# EAGLE design power_adc_module (EAGLE 9.6.2)
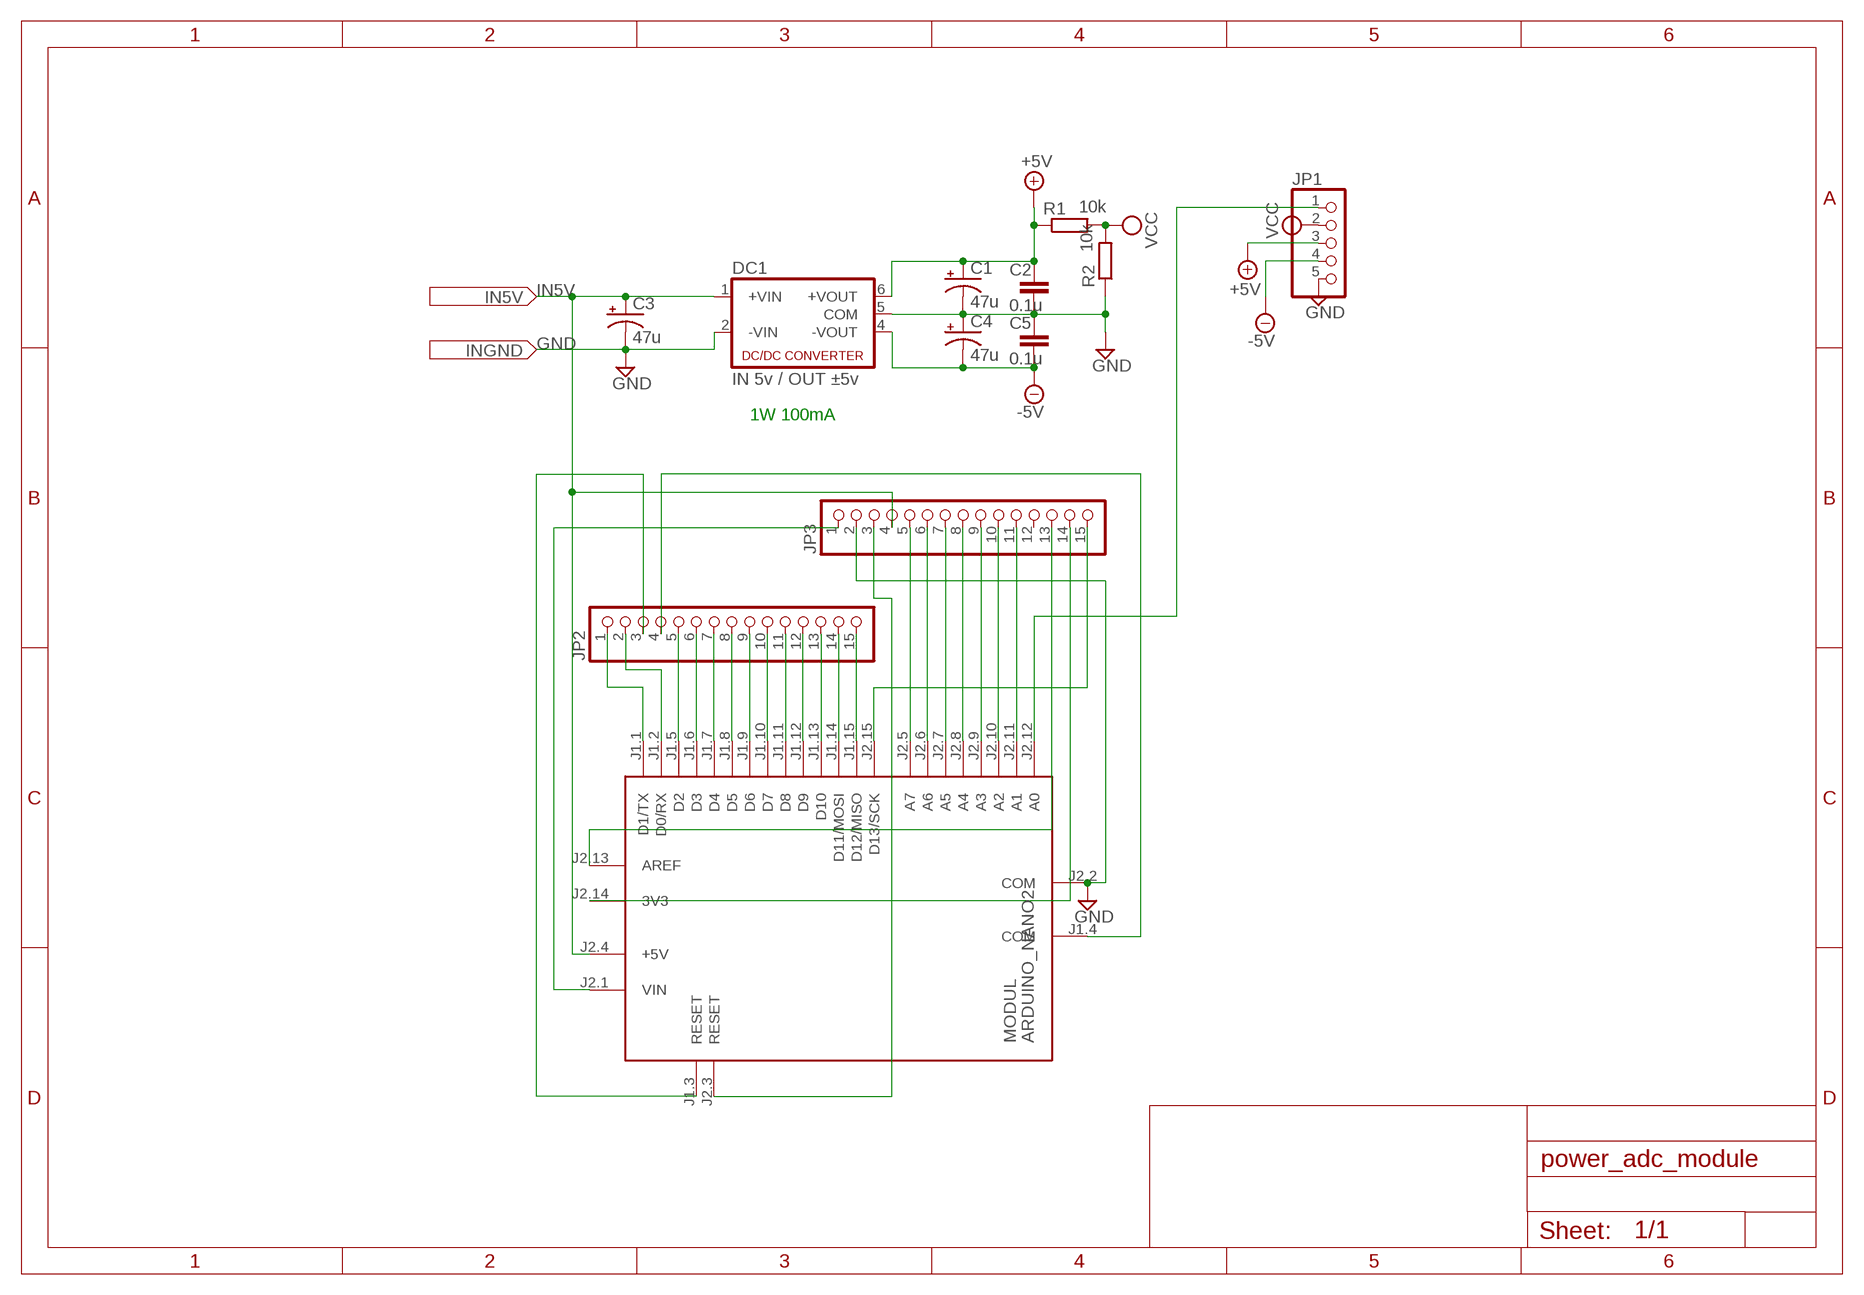
[diagram p0: schematic, sheet 1]

## Parts
C1  47u  CPOL-USE2.5-5  [E2,5-5]
C2  0.1u  C-EU025-024X044  [C025-024X044]
C3  47u  CPOL-USE2.5-5  [E2,5-5]
C4  47u  CPOL-USE2.5-5  [E2,5-5]
C5  0.1u  C-EU025-024X044  [C025-024X044]
DC1  IN 5v / OUT ±5v  NMA  [NMA]
JP1  PINHD-1X5  [1X05]
JP2  PINHD-1X15  [1X15]
JP3  PINHD-1X15  [1X15]
MODUL  ARDUINO_NANO2  [ARDUINO_NANO2]
R1  10k  R-EU_0204/7  [0204/7]
R2  10k  R-EU_0204/7  [0204/7]

## Nets
+5V: C1.+ C2.1 DC1.6(+VOUT) JP1.3 R1.1
-5V: C4.- C5.2 DC1.4(-VOUT) JP1.4
GND: C1.- C2.2 C3.- C4.+ C5.1 DC1.2(-VIN) DC1.5(COM) JP1.5 JP3.2 MODUL.J2.2(COM) R2.1
IN5V: C3.+ DC1.1(+VIN) JP3.4 MODUL.J2.4(+5V)
N$1: JP1.1 MODUL.J2.12(A0)
N$2: JP2.2 MODUL.J1.2(D0/RX)
N$3: JP2.1 MODUL.J1.1(D1/TX)
N$4: JP2.3 MODUL.J1.3(RESET)
N$5: JP2.4 MODUL.J1.4(COM)
N$6: JP2.5 MODUL.J1.5(D2)
N$7: JP2.6 MODUL.J1.6(D3)
N$8: JP2.7 MODUL.J1.7(D4)
N$9: JP2.8 MODUL.J1.8(D5)
N$10: JP2.9 MODUL.J1.9(D6)
N$11: JP2.10 MODUL.J1.10(D7)
N$12: JP2.11 MODUL.J1.11(D8)
N$13: JP2.12 MODUL.J1.12(D9)
N$14: JP2.13 MODUL.J1.13(D10)
N$15: JP2.14 MODUL.J1.14(D11/MOSI)
N$16: JP2.15 MODUL.J1.15(D12/MISO)
N$17: JP3.1 MODUL.J2.1(VIN)
N$18: JP3.3 MODUL.J2.3(RESET)
N$19: JP3.5 MODUL.J2.5(A7)
N$20: JP3.6 MODUL.J2.6(A6)
N$21: JP3.7 MODUL.J2.7(A5)
N$22: JP3.8 MODUL.J2.8(A4)
N$23: JP3.9 MODUL.J2.9(A3)
N$24: JP3.10 MODUL.J2.10(A2)
N$25: JP3.11 MODUL.J2.11(A1)
N$26: JP3.15 MODUL.J2.15(D13/SCK)
N$27: JP3.13 MODUL.J2.13(AREF)
N$28: JP3.14 MODUL.J2.14(3V3)
VCC: JP1.2 R1.2 R2.2
Unconnected: JP3.12

## Notes on the sheet
- 1W 100mA

## Library data of the parts
C1 C3 C4 = rcl:CPOL-US: POLARIZED CAPACITOR, American symbol; SPICEPREFIX: C
C2 C5 = rcl:C-EU: CAPACITOR, European symbol; SPICEPREFIX: C
DC1 = dc-dc-converter:NMA: DC-DC CONVERTER; MF: C & D TECHNOLOGIES, INC; MPN: NMA0515SC; OC_FARNELL: 1021434; OC_NEWARK: 61K3064
JP1 = pinhead:PINHD-1X5: PIN HEADER
JP2 JP3 = pinhead:PINHD-1X15: PIN HEADER
MODUL = arduino:ARDUINO_NANO2: Arduino Nano2 Auto generated by modulcreator.ulp \;; ANZAHL: 2; MODUL: TRUE; STECKX0: -76200; STECKX1: 76200; STECKY0: 177800; STECKY1: 177800
R1 R2 = rcl:R-EU_: RESISTOR, European symbol; SPICEPREFIX: R

## Net classes
0 default: width 1.27 mm, clearance 0.381 mm

## Board
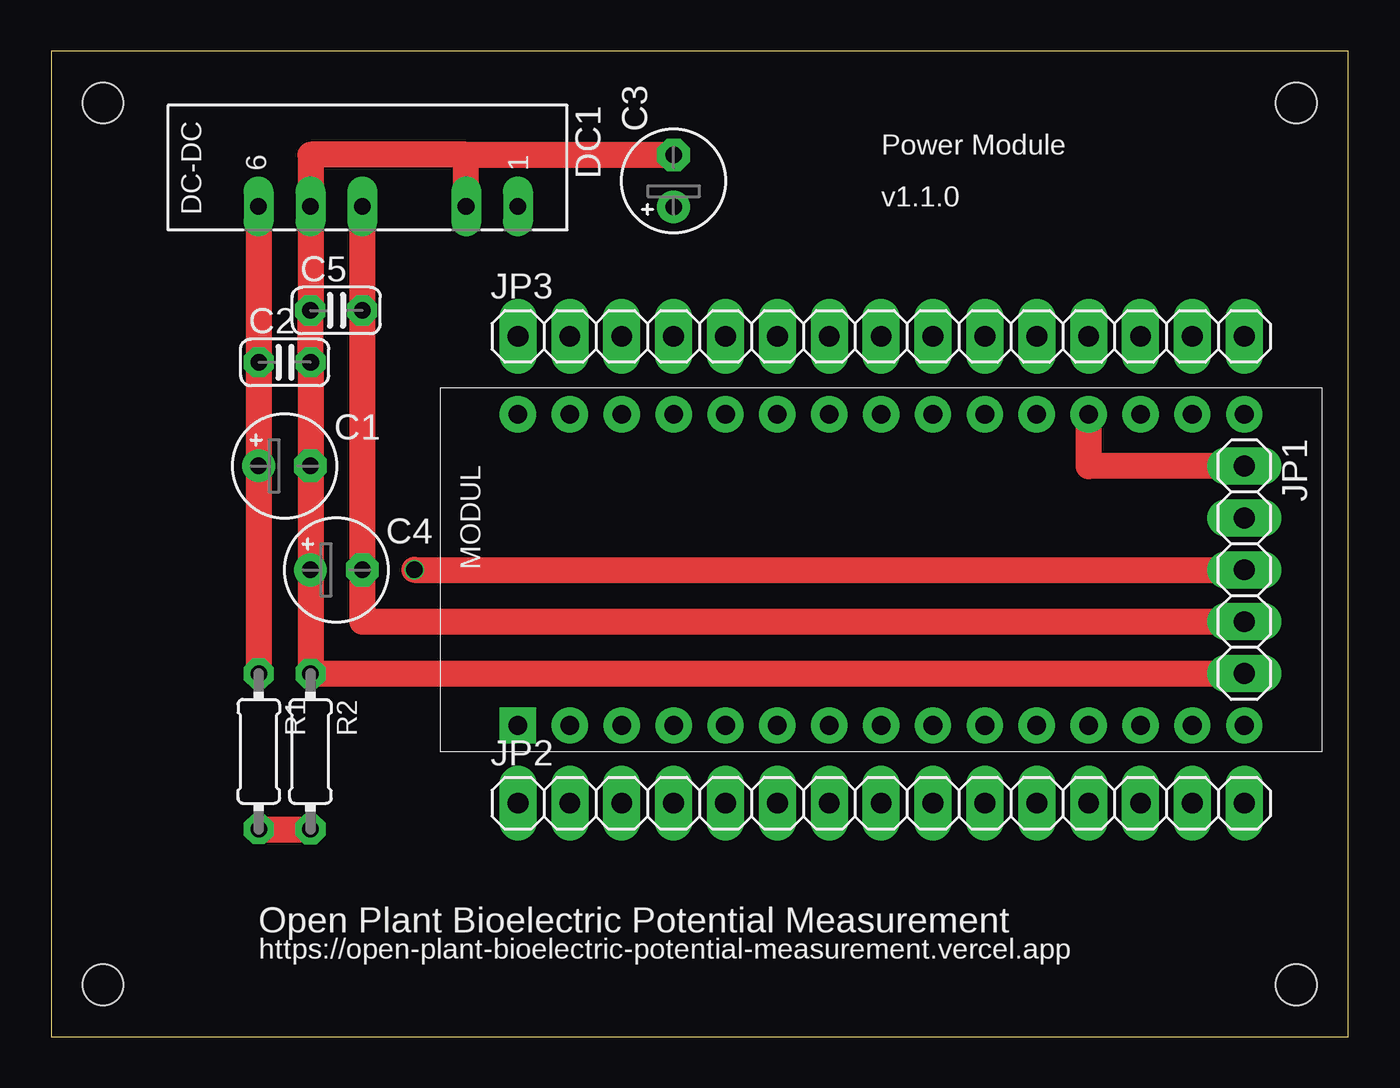
[diagram p1: board, top side]
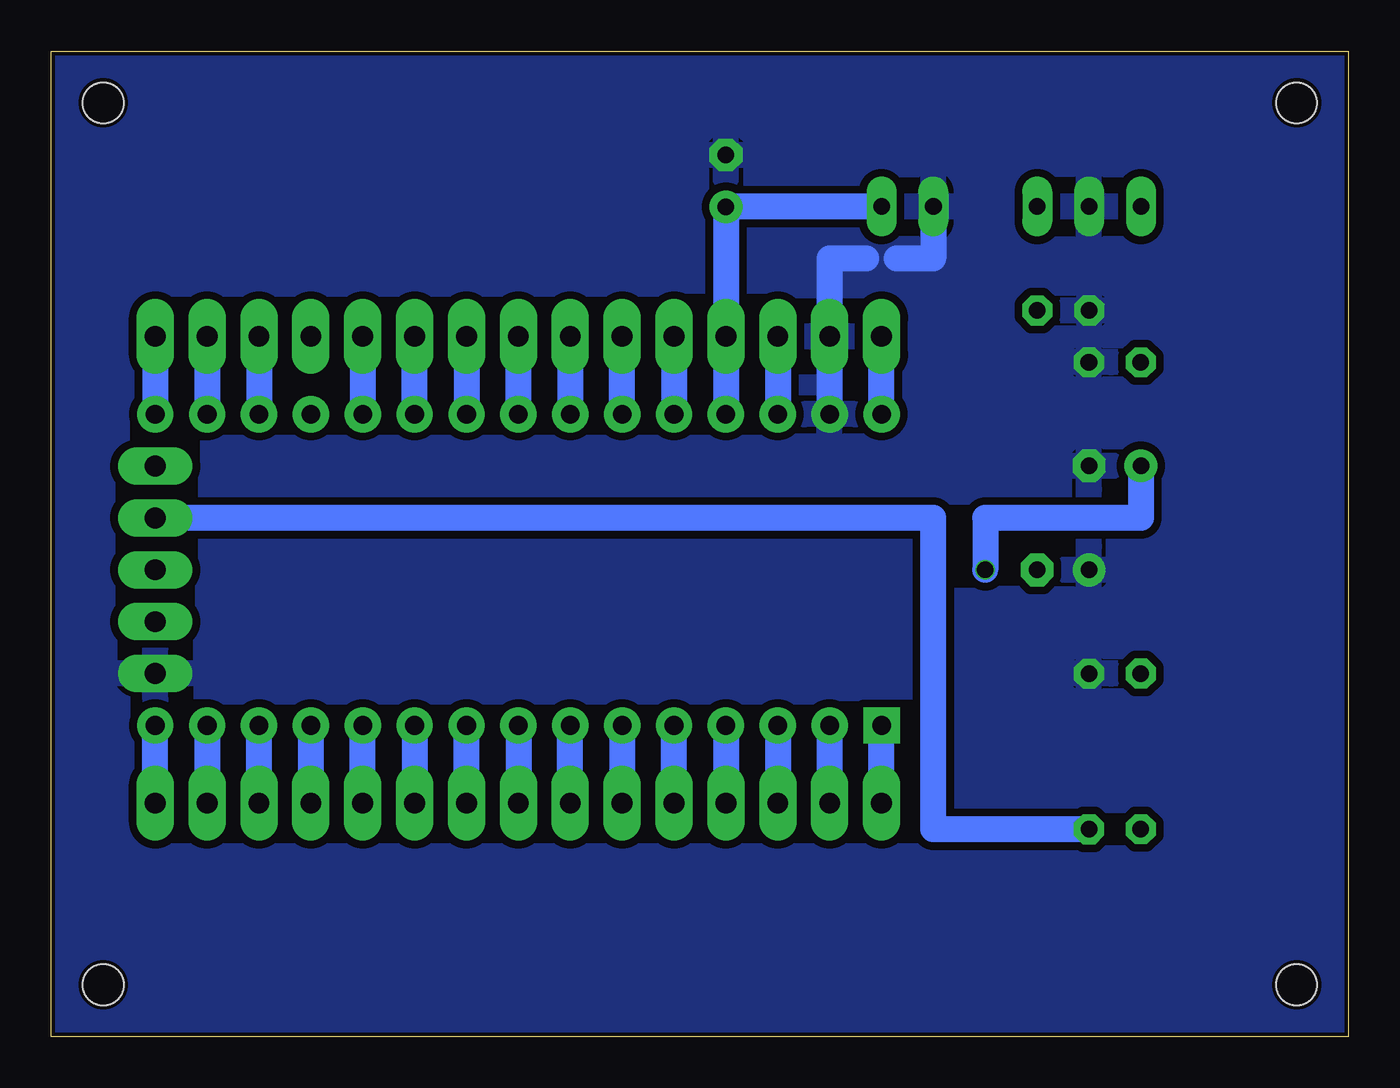
[diagram p2: board, bottom side, seen from below]

Size 63.52 x 48.26 mm. Coordinates in mm from the lower left corner, seen from the top.
Outline: 0,0 63.52,0 63.5,48.26 0,48.26 0,0
Copper layers (1*16): Top 0.035mm / dielectric 1.6mm / Bottom 0.035mm
Design rules "jlcpcb-2layers": minimum track width 5mil, minimum drill 0.3mm, track to track 5mil, track to pad 5mil, pad to pad 5mil, via to via 5mil, smd to smd 5mil, copper to edge 0.2mm, drill to drill 6mil, minimum pad ring 10mil, minimum via ring 3mil, stop-mask expansion 4mil, vias tented up to drill 0mil, thermal gap 10mil
Holes 2 mm at 2.54,45.72 2.54,2.54 60.96,45.72 60.96,2.54

### Footprints (pad centres in the part's own frame; a part is rotated, then mirrored left to right if it is on the bottom)
E2,5-5 = drill 0.813 pad 1.6: + -1.27,0 | drill 0.813 pad 1.6 octagon: - 1.27,0
C025-024X044 = drill 0.813 octagon: 1 -1.27,0; 2 1.27,0
NMA = drill 0.813 long: 1 0,6.35; 2 0,3.81; 4 0,-1.27; 5 0,-3.81; 6 0,-6.35
1X05 = drill 1.016 long: 1 -5.08,0; 2 -2.54,0; 3 0,0; 4 2.54,0; 5 5.08,0
1X15 = drill 1.016 long: 1 -17.78,0; 2 -15.24,0; 3 -12.7,0; 4 -10.16,0; 5 -7.62,0; 6 -5.08,0; 7 -2.54,0; 8 0,0; 9 2.54,0; 10 5.08,0; 11 7.62,0; 12 10.16,0; 13 12.7,0; 14 15.24,0; 15 17.78,0
ARDUINO_NANO2 = drill 0.914 pad 1.778 square: J1.1 -7.62,17.78 | drill 0.914 pad 1.778: J1.2 -7.62,15.24; J1.3 -7.62,12.7; J1.4 -7.62,10.16; J1.5 -7.62,7.62; J1.6 -7.62,5.08; J1.7 -7.62,2.54; J1.8 -7.62,0; J1.9 -7.62,-2.54; J1.10 -7.62,-5.08; J1.11 -7.62,-7.62; J1.12 -7.62,-10.16; J1.13 -7.62,-12.7; J1.14 -7.62,-15.24; J1.15 -7.62,-17.78; J2.1 7.62,17.78; J2.2 7.62,15.24; J2.3 7.62,12.7; J2.4 7.62,10.16; J2.5 7.62,7.62; J2.6 7.62,5.08; J2.7 7.62,2.54; J2.8 7.62,0; J2.9 7.62,-2.54; J2.10 7.62,-5.08; J2.11 7.62,-7.62; J2.12 7.62,-10.16; J2.13 7.62,-12.7; J2.14 7.62,-15.24; J2.15 7.62,-17.78
0204/7 = drill 0.813 octagon: 1 -3.81,0; 2 3.81,0

### Placement (x,y rotation side)
C1  11.43,27.95 0 top
C2  11.44,33.02 0 top
C3  30.48,41.9 90 top
C4  13.97,22.85 0 top
C5  13.96,35.56 0 top
DC1  16.51,40.65 270 top
JP1  58.42,22.86 270 top
JP2  40.64,11.43 0 top
JP3  40.64,34.29 0 top
MODUL  40.64,22.86 90 top
R1  10.17,13.97 270 top
R2  12.7,13.96 270 top

### Tracks (layer width: path | path; a pad name or v marks a point on that pad's centre or on a via)
+5V  (via drill 0.8)
  Top 1.27: C1.+ | C1.+ R1.1 | DC1.6 C2.1 C1.+ | v17.78,22.86 JP1.3
  Bottom 1.27: C1.+ 10.16,25.4 17.78,25.4 v17.78,22.86
-5V
  Top 1.27: JP1.4 15.24,20.32 C4.- C5.2 DC1.4
GND
  Top 1.27: 20.32,43.18 DC1.2 20.32,40.63 | 20.32,43.18 12.7,43.18 DC1.5 C5.1 | C5.1 | C5.1 C2.2 C1.- C4.+ R2.1 JP1.5 | 20.32,43.18 C3.-
  Bottom 1.27: MODUL.J2.2 JP3.2 25.4,38.1 23.62,38.1 23.6,38.12 | DC1.2 20.32,38.1 22.1,38.1 22.12,38.12
  pour Bottom: -2.54,50.8 68.58,50.8 71.12,-2.54 -2.54,-2.54
IN5V
  Bottom 1.27: MODUL.J2.4 JP3.4 C3.+ 22.87,40.63 DC1.1
N$1
  Top 1.27: JP1.1 50.8,27.94 MODUL.J2.12
N$2
  Bottom 1.27: MODUL.J1.2 JP2.2
N$3
  Bottom 1.27: JP2.1 MODUL.J1.1
N$4
  Bottom 1.27: MODUL.J1.3 JP2.3
N$5
  Bottom 1.27: MODUL.J1.4 JP2.4
N$6
  Bottom 1.27: JP2.5 MODUL.J1.5
N$7
  Bottom 1.27: MODUL.J1.6 JP2.6
N$8
  Bottom 1.27: JP2.7 MODUL.J1.7
N$9
  Bottom 1.27: MODUL.J1.8 JP2.8
N$10
  Bottom 1.27: JP2.9 MODUL.J1.9
N$11
  Bottom 1.27: MODUL.J1.10 JP2.10
N$12
  Bottom 1.27: JP2.11 MODUL.J1.11
N$13
  Bottom 1.27: MODUL.J1.12 JP2.12
N$14
  Bottom 1.27: JP2.13 MODUL.J1.13
N$15
  Bottom 1.27: MODUL.J1.14 JP2.14
N$16
  Bottom 1.27: JP2.15 MODUL.J1.15
N$17
  Bottom 1.27: MODUL.J2.1 JP3.1
N$18
  Bottom 1.27: JP3.3 MODUL.J2.3
N$19
  Bottom 1.27: JP3.5 MODUL.J2.5
N$20
  Bottom 1.27: MODUL.J2.6 JP3.6
N$21
  Bottom 1.27: JP3.7 MODUL.J2.7
N$22
  Bottom 1.27: MODUL.J2.8 JP3.8
N$23
  Bottom 1.27: JP3.9 MODUL.J2.9
N$24
  Bottom 1.27: MODUL.J2.10 JP3.10
N$25
  Bottom 1.27: JP3.11 MODUL.J2.11
N$26
  Bottom 1.27: JP3.15 MODUL.J2.15
N$27
  Bottom 1.27: JP3.13 MODUL.J2.13
N$28
  Bottom 1.27: JP3.14 MODUL.J2.14
VCC
  Top 1.27: R1.2 R2.2
  Bottom 1.27: R2.2 20.32,10.16 20.32,25.4 JP1.2

### Text on the board
tPlace: Power Module | v1.1.0 | Open Plant Bioelectric Potential Measurement | https://open-plant-bioelectric-potential-measurement.vercel.app